# EasyEDA schematic New Project.json
TITLE: Sheet_1; REV: 1.0; Date: 2024-12-19; Sheet: 1/1; Company: Your Company
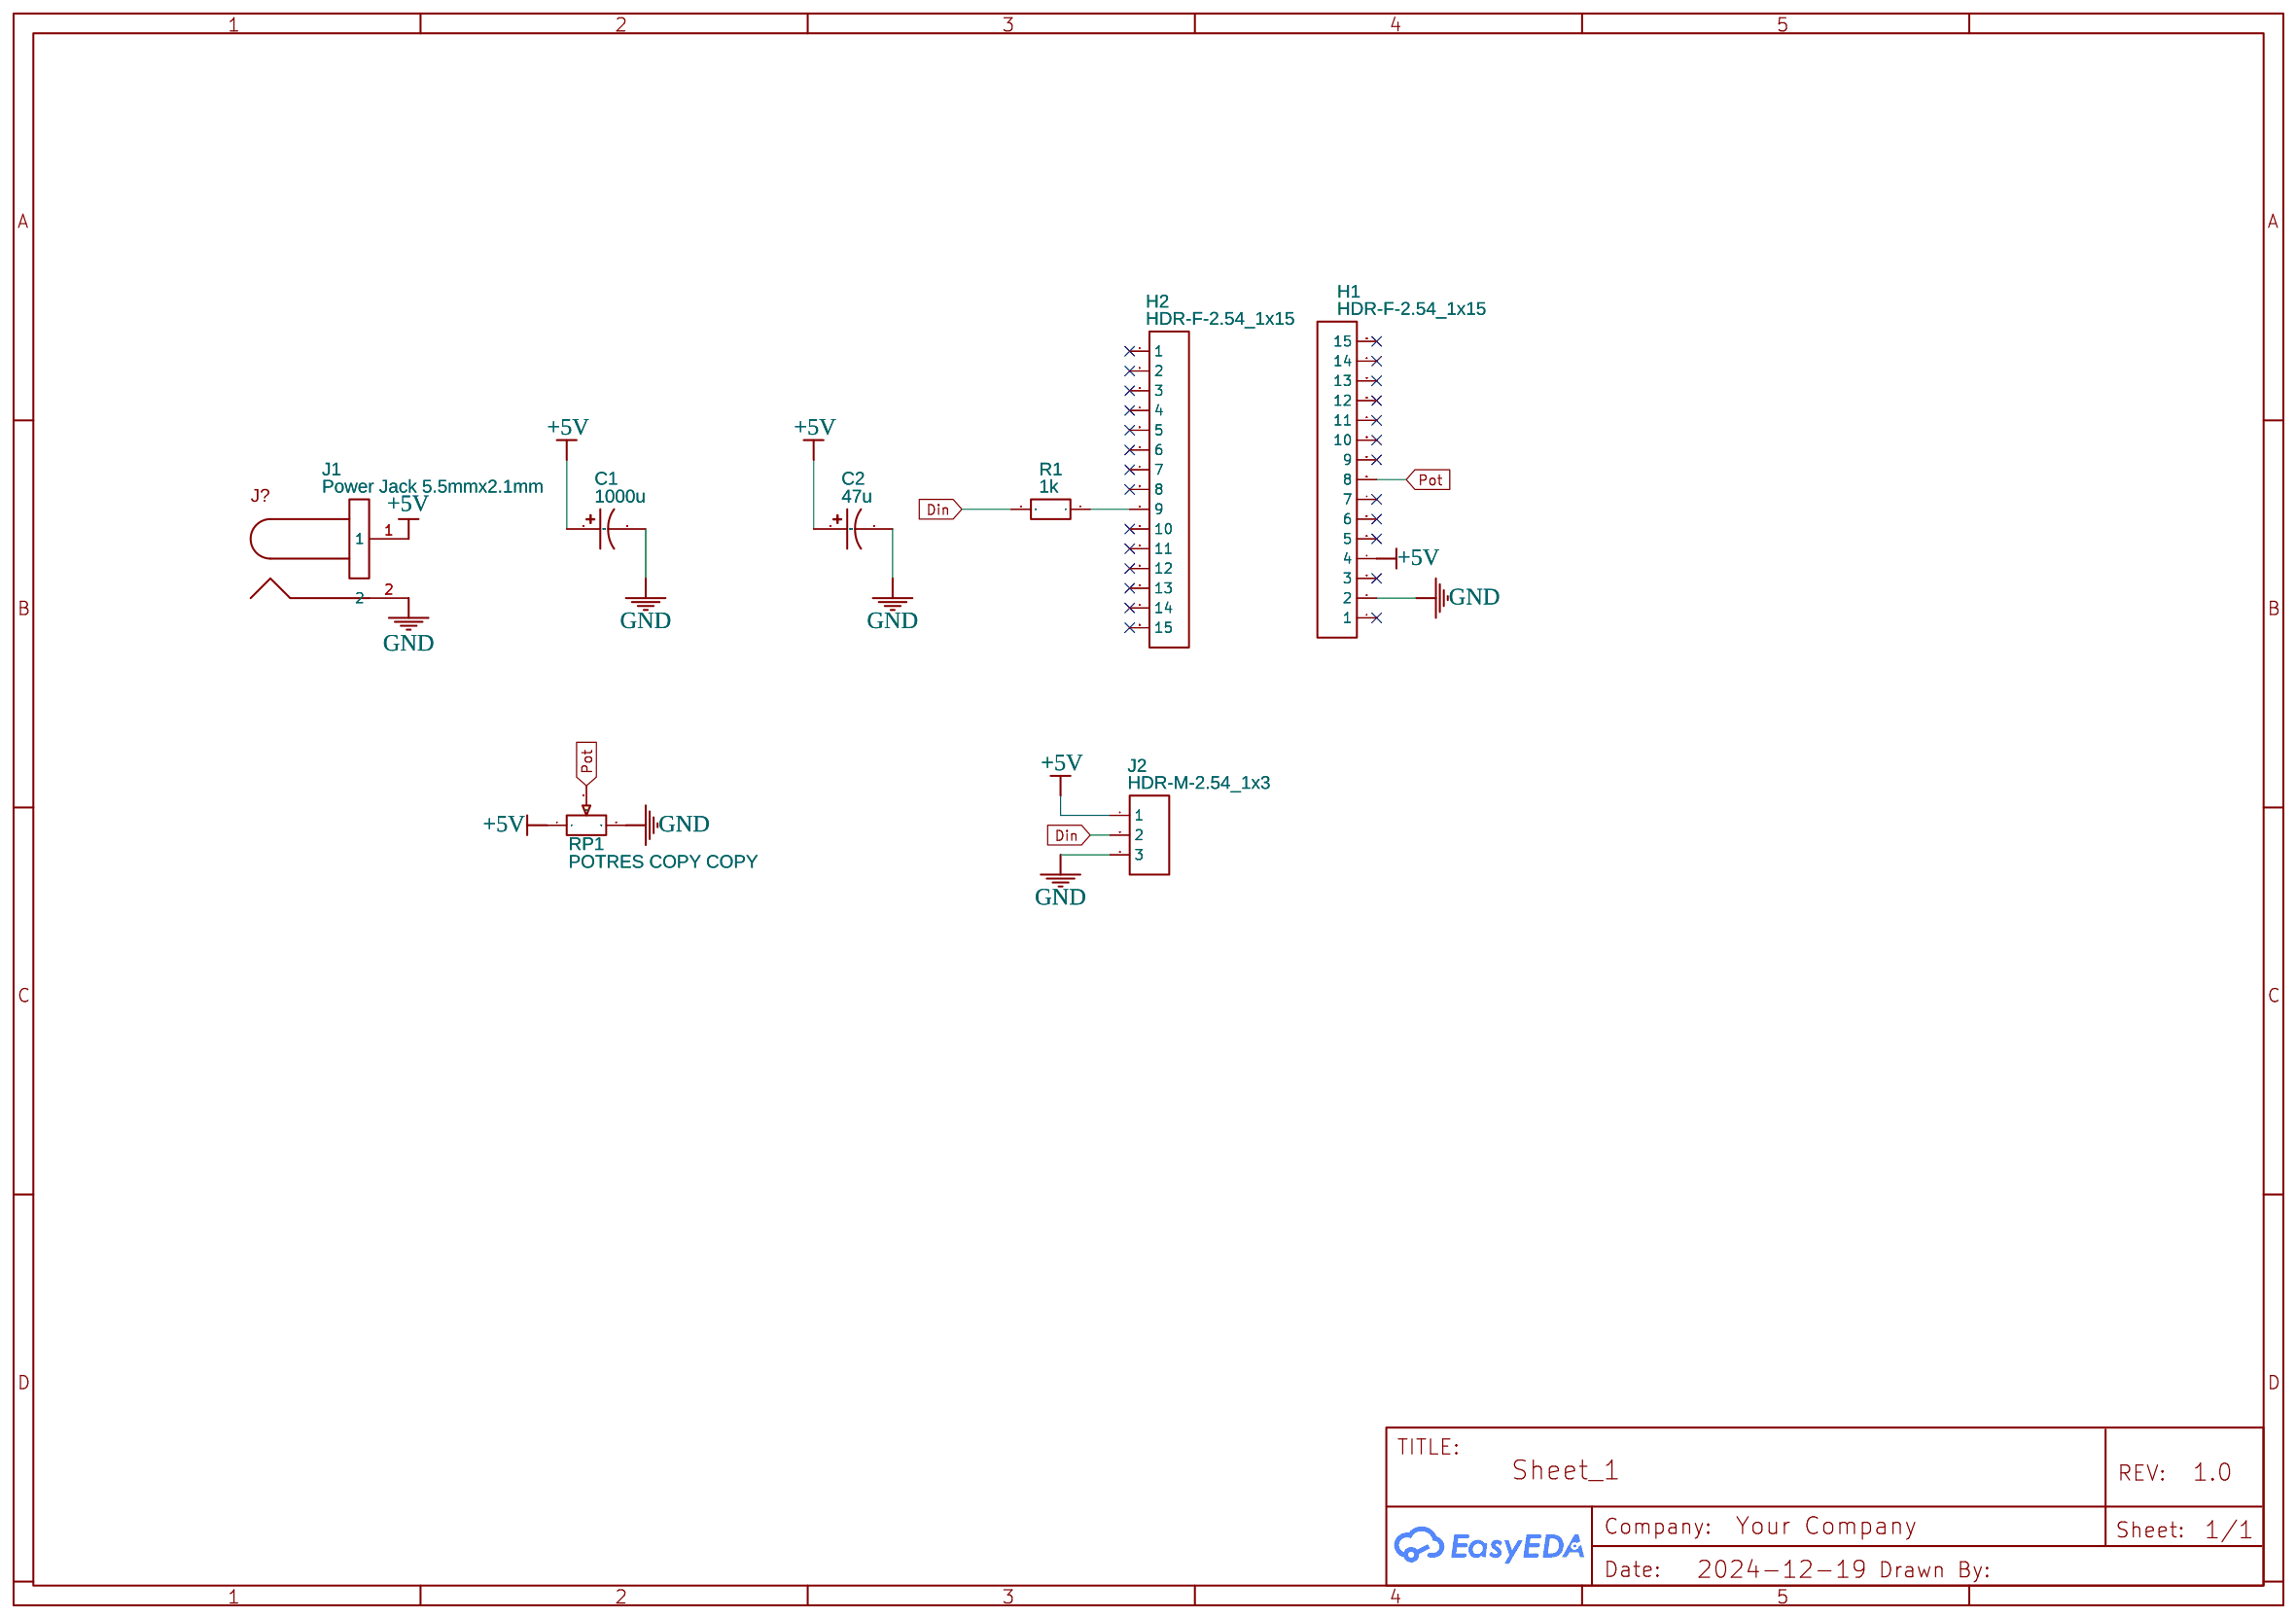
[diagram p0: schematic sheet]

## Parts
C1  1000u  [CAP-D4.0×F2.5]
C2  47u  [CAP-D4.0×F2.5]
H1  HDR-F-2.54_1x15  [HDR-TH_12P-P2.54-V-M_PZ-2.54-38-3-7-1X12]
H2  HDR-F-2.54_1x15  [HDR-TH_12P-P2.54-V-M_PZ-2.54-38-3-7-1X12]
J1  Power Jack 5.5mmx2.1mm  [DC JACK 5.5MM X 2.1MM_1]
J2  HDR-M-2.54_1x3  [HDR-M-2.54_1X3]
R1  1k  [R_AXIAL-0.4]
RP1  POTRES COPY COPY  [ПОТЕНЦИОМЕТР]

## Library data of the parts
C1 C2 = CE_TH_D4.0×F1.5_US: Contributor: LCEDA_Lib
H1 H2 = HDR-F-2.54_1x15: Supplier Part: C124408; Supplier: LCSC; Contributor: LCEDA_Lib
J1 = Power Jack 5.5mmx2.1mm: Manufacturer: Tensility; Manufacturer Part: 54-00166; Supplier: Digi-Key; Supplier Part: 839-54-00166-ND; link: https://www.digikey.com/product-detail/en/tensility-international-corp/54-00129/839-1512-ND/9685438; Contributor: maximochka22
J2 = HDR-M-2.54_1x3: Supplier Part: C180248; Supplier: LCSC; Contributor: LCEDA_Lib
R1 = R_AXIAL-0.4_EU: Contributor: LCEDA_Lib
RP1 = POTRES COPY COPY: Contributor: ttnigmatyllin

## Nets
+5V: C1.1 C2.1 H1.4 J1.1 J2.1 RP1.1
GND: C1.2 C2.2 H1.2 J1.2 J2.3 RP1.3
Din: J2.2 R1.2
Pot: H1.8 RP1.2
Net-(H2-9): H2.9 R1.1

Not connected (* = marked no-connect by the designer): H1 1* 3* 5* 6* 7* 9* 10* 11* 12* 13* 14* 15*; H2 1* 2* 3* 4* 5* 6* 7* 8* 10* 11* 12* 13* 14* 15*
